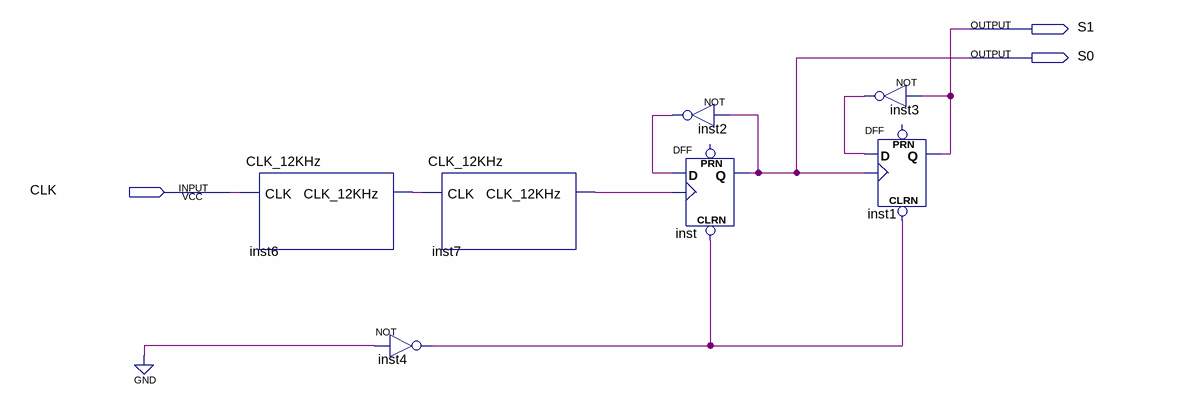
[diagram p0: schematic sheet]
// Quartus schematic Sequencer_Slow.bdf as structural Verilog: 7 symbols, 3 pins
module Sequencer_Slow (
  input  CLK,
  output S1,
  output S0
);

  wire inst2_out, inst3_out, inst4_out, inst6_clk_12khz, inst7_clk_12khz;

  CLK_12KHz inst6 (.CLK(CLK), .CLK_12KHz(inst6_clk_12khz));
  not inst4 (inst4_out, 1'b0);
  CLK_12KHz inst7 (.CLK(inst6_clk_12khz), .CLK_12KHz(inst7_clk_12khz));
  not inst2 (inst2_out, S0);
  DFF inst (.CLRN(inst4_out), .CLK(inst7_clk_12khz), .D(inst2_out), .Q(S0));  // open: PRN
  not inst3 (inst3_out, S1);
  DFF inst1 (.CLRN(inst4_out), .CLK(S0), .D(inst3_out), .Q(S1));  // open: PRN
endmodule
